# Altium schematic sheet sch_cm4_hdmi.SchDoc
size A3; SheetNumber: 5; SheetTotal: 7
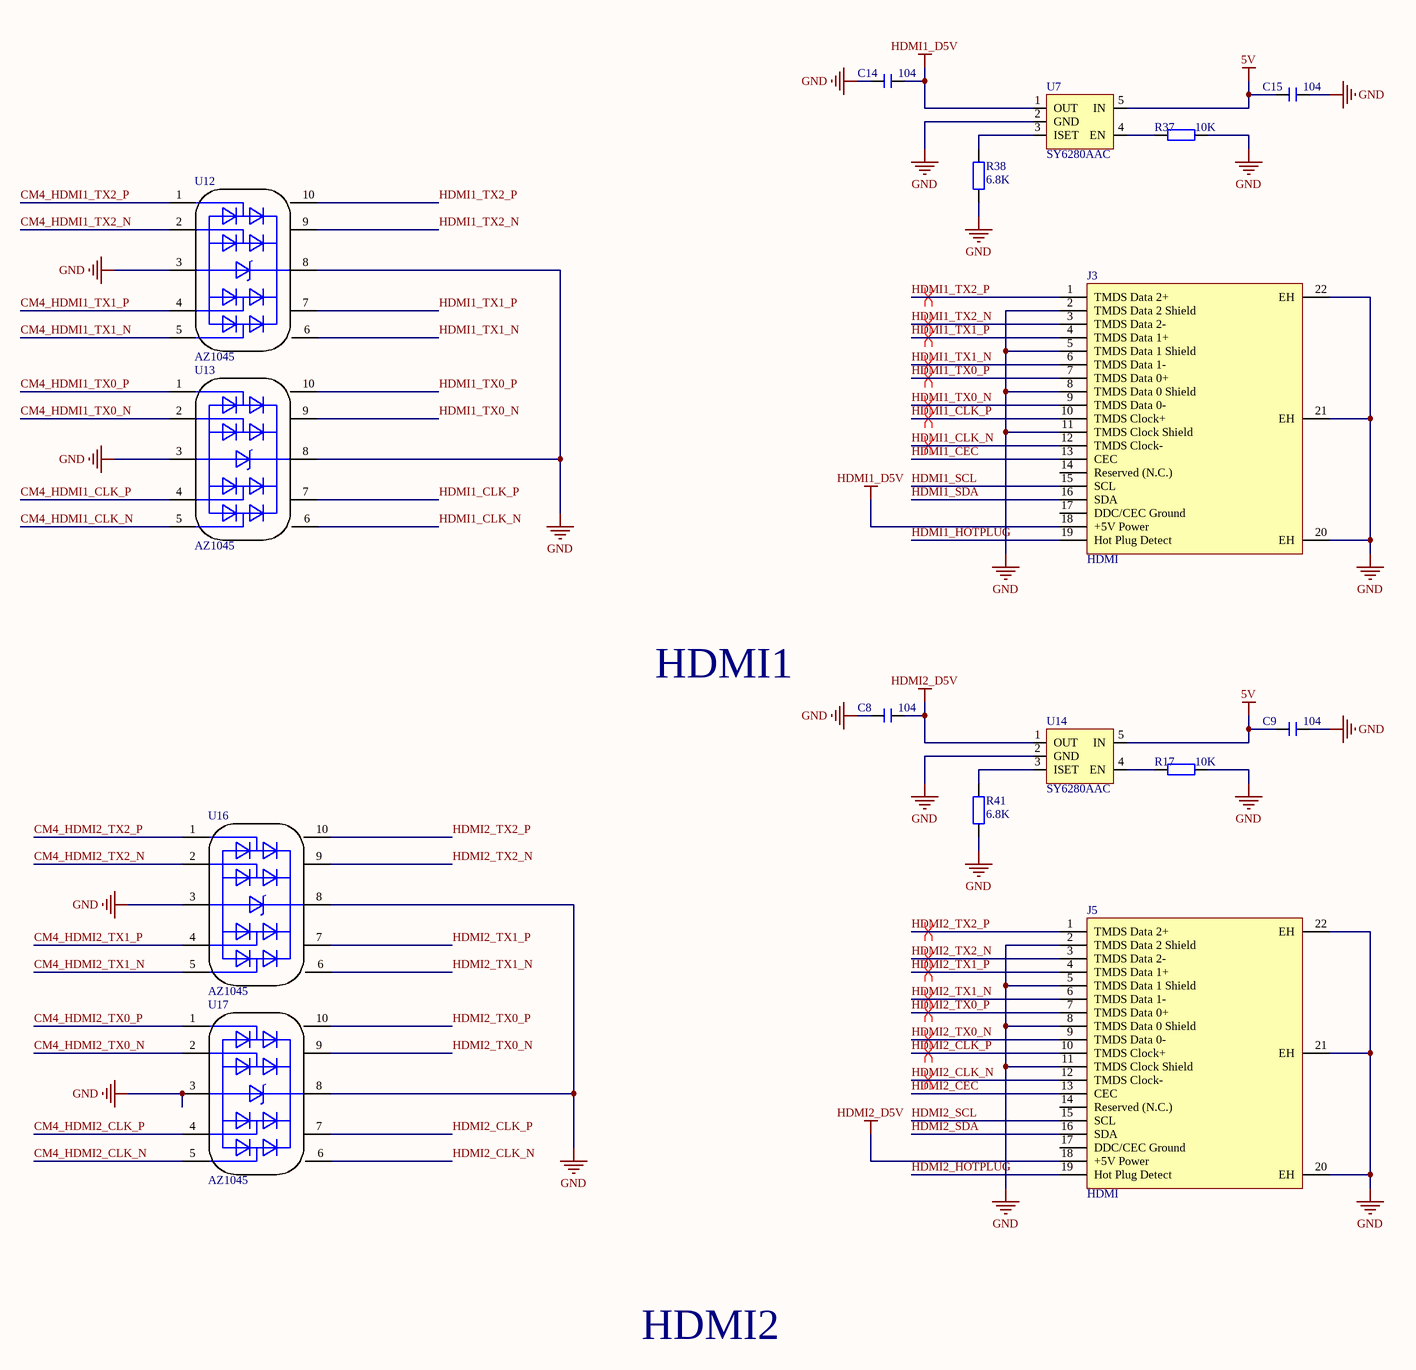
[diagram p0: sch_cm4_hdmi.SchDoc]

## Parts
C8  104  [C 0402_L]
C9  104  [C 0402_L]
C14  104  [C 0402_L]
C15  104  [C 0402_L]
J3  HDMI  [HDMI连接器]
J5  HDMI  [HDMI连接器]
R17  10K  [R 0805_L]
R37  10K  [R 0805_L]
R38  6.8K  [R 0805_L]
R41  6.8K  [R 0805_L]
U7  SY6280AAC  [PCBComponent_1]
U12  AZ1045  [AZ1045-04F]
U13  AZ1045  [AZ1045-04F]
U14  SY6280AAC  [PCBComponent_1]
U16  AZ1045  [AZ1045-04F]
U17  AZ1045  [AZ1045-04F]

## Nets
5V: C9.2 C15.2 U7.5(IN) U14.5(IN)
GND: C8.2 C9.1 C14.2 C15.1 J3.2(TMDS_Data_2_Shield) J3.5(TMDS_Data_1_Shield) J3.8(TMDS_Data_0_Shield) J3.11(TMDS_Clock_Shield) J3.20(EH) J3.21(EH) J3.22(EH) J5.2(TMDS_Data_2_Shield) J5.5(TMDS_Data_1_Shield) J5.8(TMDS_Data_0_Shield) J5.11(TMDS_Clock_Shield) J5.20(EH) J5.21(EH) J5.22(EH) R17.2 R37.2 R38.1 R41.1 U7.2(GND) U12.3(GND) U12.8(GND) U13.3(GND) U13.8(GND) U14.2(GND) U16.3(GND) U16.8(GND) U17.3(GND) U17.8(GND)
HDMI1_D5V: C14.1 J3.18(+5V_Power) U7.1(OUT)
HDMI2_D5V: C8.1 J5.18(+5V_Power) U14.1(OUT)
CM4_HDMI1_CLK_N: U13.5(I/O_4)
CM4_HDMI1_CLK_P: U13.4(I/O_3)
CM4_HDMI1_TX0_N: U13.2(I/O_2)
CM4_HDMI1_TX0_P: U13.1(I/O_1)
CM4_HDMI1_TX1_N: U12.5(I/O_4)
CM4_HDMI1_TX1_P: U12.4(I/O_3)
CM4_HDMI1_TX2_N: U12.2(I/O_2)
CM4_HDMI1_TX2_P: U12.1(I/O_1)
CM4_HDMI2_CLK_N: U17.5(I/O_4)
CM4_HDMI2_CLK_P: U17.4(I/O_3)
CM4_HDMI2_TX0_N: U17.2(I/O_2)
CM4_HDMI2_TX0_P: U17.1(I/O_1)
CM4_HDMI2_TX1_N: U16.5(I/O_4)
CM4_HDMI2_TX1_P: U16.4(I/O_3)
CM4_HDMI2_TX2_N: U16.2(I/O_2)
CM4_HDMI2_TX2_P: U16.1(I/O_1)
HDMI1_CEC: J3.13(CEC)
HDMI1_CLK_N: J3.12(TMDS_Clock-) U13.6(NC)
HDMI1_CLK_P: J3.10(TMDS_Clock+) U13.7(NC)
HDMI1_HOTPLUG: J3.19(Hot_Plug_Detect)
HDMI1_SCL: J3.15(SCL)
HDMI1_SDA: J3.16(SDA)
HDMI1_TX0_N: J3.9(TMDS_Data_0-) U13.9(NC)
HDMI1_TX0_P: J3.7(TMDS_Data_0+) U13.10(NC)
HDMI1_TX1_N: J3.6(TMDS_Data_1-) U12.6(NC)
HDMI1_TX1_P: J3.4(TMDS_Data_1+) U12.7(NC)
HDMI1_TX2_N: J3.3(TMDS_Data_2-) U12.9(NC)
HDMI1_TX2_P: J3.1(TMDS_Data_2+) U12.10(NC)
HDMI2_CEC: J5.13(CEC)
HDMI2_CLK_N: J5.12(TMDS_Clock-) U17.6(NC)
HDMI2_CLK_P: J5.10(TMDS_Clock+) U17.7(NC)
HDMI2_HOTPLUG: J5.19(Hot_Plug_Detect)
HDMI2_SCL: J5.15(SCL)
HDMI2_SDA: J5.16(SDA)
HDMI2_TX0_N: J5.9(TMDS_Data_0-) U17.9(NC)
HDMI2_TX0_P: J5.7(TMDS_Data_0+) U17.10(NC)
HDMI2_TX1_N: J5.6(TMDS_Data_1-) U16.6(NC)
HDMI2_TX1_P: J5.4(TMDS_Data_1+) U16.7(NC)
HDMI2_TX2_N: J5.3(TMDS_Data_2-) U16.9(NC)
HDMI2_TX2_P: J5.1(TMDS_Data_2+) U16.10(NC)
NetR17_1: R17.1 U14.4(EN)
NetR37_1: R37.1 U7.4(EN)
NetR38_2: R38.2 U7.3(ISET)
NetR41_2: R41.2 U14.3(ISET)

Not connected (* = marked no-connect by the designer): J3 14(Reserved_(N.C.)) 17(DDC/CEC_Ground); J5 14(Reserved_(N.C.)) 17(DDC/CEC_Ground)

## Layout directives
differential pair: HDMI1_CLK_N, HDMI1_CLK_P, HDMI1_TX0_N, HDMI1_TX0_P, HDMI1_TX1_N, HDMI1_TX1_P, HDMI1_TX2_N, HDMI1_TX2_P, HDMI2_CLK_N, HDMI2_CLK_P, HDMI2_TX0_N, HDMI2_TX0_P, HDMI2_TX1_N, HDMI2_TX1_P, HDMI2_TX2_N, HDMI2_TX2_P

## Notes on the sheet
- HDMI1
- HDMI2

## Library data of the parts
C8 C9 C14 C15 = C: 贴片电容; BOM名称: 无极性贴片电容; 淘宝ID: 封装库来自淘宝 ID：黄晶宝石; 联系售后，技术支持: https://shop463601444.taobao.com; 唯一出售店铺网址: https://shop463601444.taobao.com
J3 J5 = HDMI连接器
R17 R37 R38 R41 = R: 贴片电阻; 版权归属: 来自淘宝 ID：黄晶宝石; 封装库来自淘宝卖家 ID：黄晶宝石: 其他店铺购入均为盗版，不享受售后技术支持服务，请立即申请退款; BOM名称: 贴片电阻; 联系售后: https://item.taobao.com/item.htm?id=566775463719